# EAGLE design pcb (EAGLE 9.5.2)
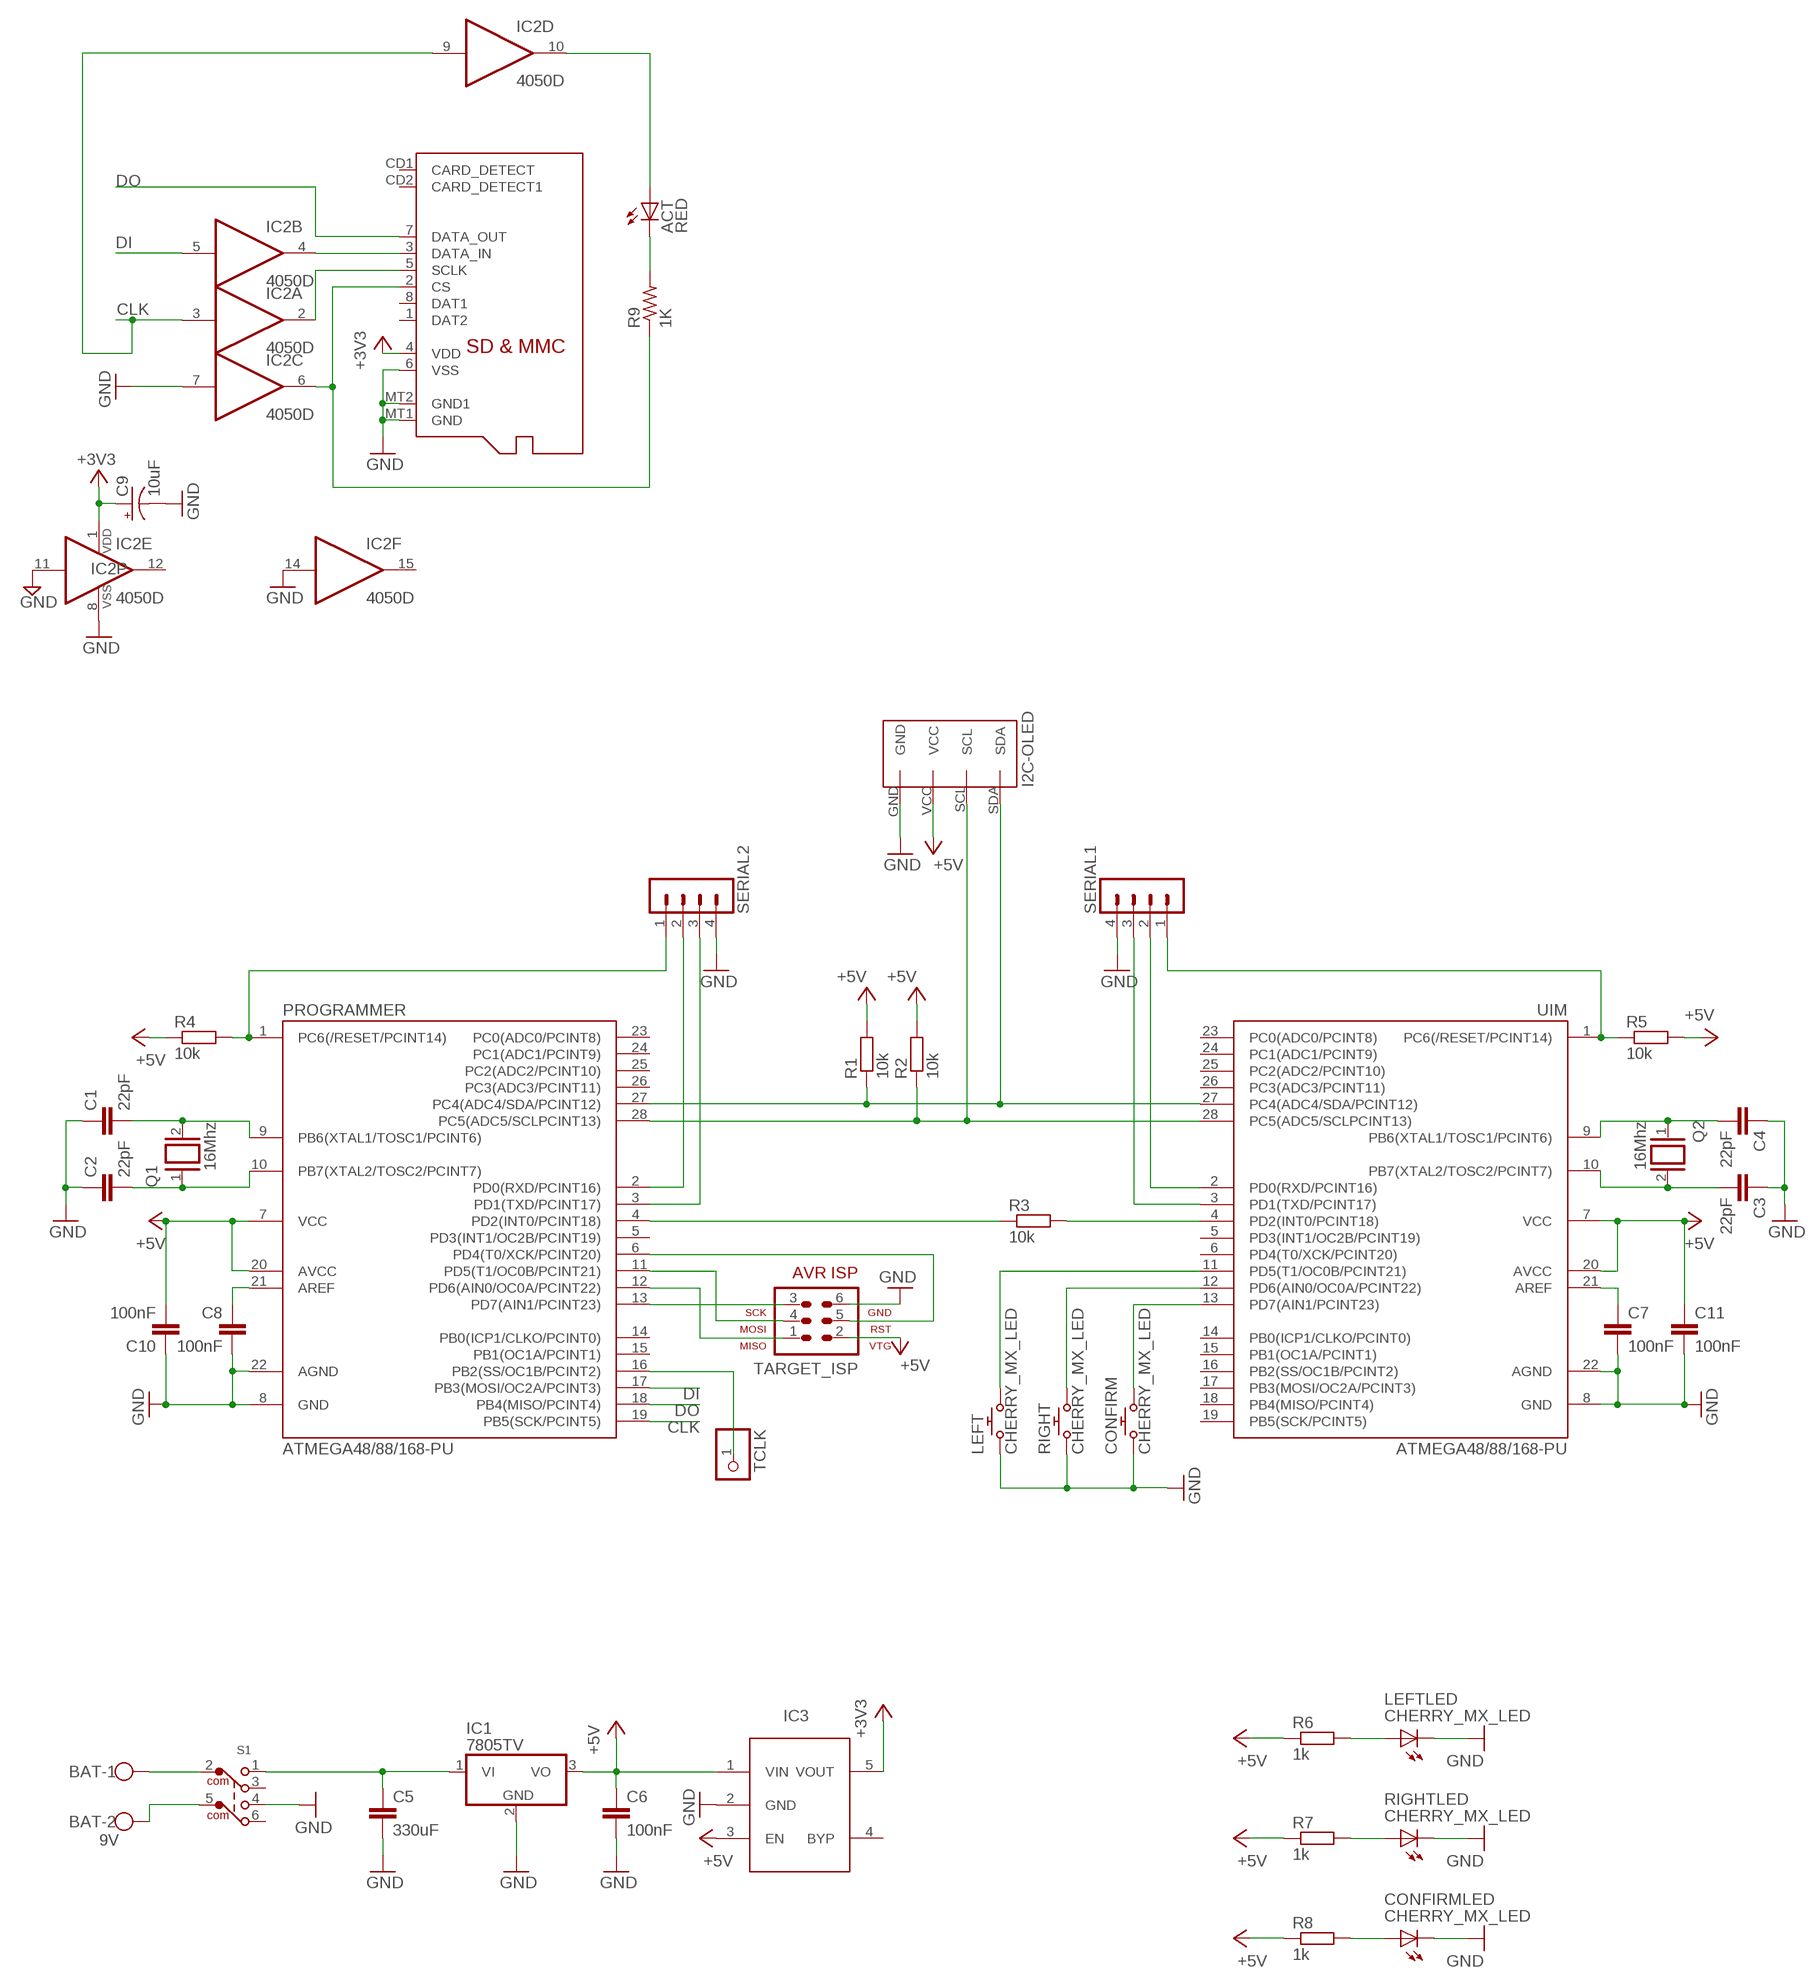
[diagram p0: schematic, sheet 1]

## Parts
ACT  RED  LEDCHIP-LED0805  [CHIP-LED0805]
BAT  9V  W237-102  [W237-102]
C1  22pF  C-EUC0805  [C0805]
C2  22pF  C-EUC0805  [C0805]
C3  22pF  C-EUC0805  [C0805]
C4  22pF  C-EUC0805  [C0805]
C5  330uF  C-EUC0805  [C0805]
C6  100nF  C-EUC0805  [C0805]
C7  100nF  C-EUC0805  [C0805]
C8  100nF  C-EUC0805  [C0805]
C9  10uF  CPOL-USA/3216-18R  [A/3216-18R]
C10  100nF  C-EUC0805  [C0805]
C11  100nF  C-EUC0805  [C0805]
CONFIRM  CHERRY_MX_LED  [CHERRY_MX_LED]
IC1  7805TV  [TO220V]
IC2  4050D  [SO16]
IC3  LP298XS  [SOT23-5L]
LEFT  CHERRY_MX_LED  [CHERRY_MX_LED]
PROGRAMMER  ATMEGA48/88/168-PU  [DIL28-3]
Q1  16Mhz  XTAL/S  [QS]
Q2  16Mhz  XTAL/S  [QS]
R1  10k  R-EU_R0805  [R0805]
R2  10k  R-EU_R0805  [R0805]
R3  10k  R-EU_R0805  [R0805]
R4  10k  R-EU_R0805  [R0805]
R5  10k  R-EU_R0805  [R0805]
R6  1k  R-EU_R0805  [R0805]
R7  1k  R-EU_R0805  [R0805]
R8  1k  R-EU_R0805  [R0805]
R9  1K  R-US_R0805  [R0805]
RIGHT  CHERRY_MX_LED  [CHERRY_MX_LED]
S1  452404020202  [452404020202]
SERIAL1  MA04-1  [MA04-1]
SERIAL2  MA04-1  [MA04-1]
TARGET_ISP  AVR-ISP-6  [AVR-ISP-6]
TCLK  PINHD-1X1  [1X01]
U$1  128X64-I2C-OLED  [128X64-I2C-OLED]
UIM  ATMEGA48/88/168-PU  [DIL28-3]
X1  MICROSD  [MICROSD]

## Nets
9V+ [power]: C5.1 IC1.1(VI) S1.1
+3V3 [power]: C9.+ IC2.1(P:VDD) IC3.5(VOUT) X1.4(VDD)
+5V [power]: C6.1 C10.2 C11.1 IC1.3(VO) IC3.1(VIN) IC3.3(EN) PROGRAMMER.7(VCC) PROGRAMMER.20(AVCC) R1.2 R2.2 R4.1 R5.2 R6.1 R7.1 R8.1 TARGET_ISP.2 U$1.VCC UIM.7(VCC) UIM.20(AVCC)
B$1: PROGRAMMER.11(PD5(T1/OC0B/PCINT21)) TARGET_ISP.4
BAT+ [power]: BAT.1 S1.2(COM)
BAT- [power]: BAT.2 S1.5(COM1)
CLK: IC2.3(A:I) IC2.9(D:I) PROGRAMMER.19(PB5(SCK/PCINT5))
DI: IC2.5(B:I) PROGRAMMER.17(PB3(MOSI/OC2A/PCINT3))
DO: PROGRAMMER.18(PB4(MISO/PCINT4)) X1.7(DATA_OUT)
GND [power]: C1.1 C2.1 C3.1 C4.1 C5.2 C6.2 C7.2 C8.2 C9.- C10.1 C11.2 CONFIRM.L2(C) CONFIRM.S1 IC1.2(GND) IC2.7(C:I) IC2.8(P:VSS) IC2.11(E:I) IC2.14(F:I) IC3.2(GND) LEFT.L2(C) LEFT.S1 PROGRAMMER.8(GND) PROGRAMMER.22(AGND) RIGHT.L2(C) RIGHT.S1 S1.4 SERIAL1.4 SERIAL2.4 TARGET_ISP.6 U$1.GND UIM.8(GND) UIM.22(AGND) X1.6(VSS) X1.MT1(GND) X1.MT2(GND1)
N$1: PROGRAMMER.28(PC5(ADC5/SCLPCINT13)) R2.1 U$1.SCL UIM.28(PC5(ADC5/SCLPCINT13))
N$2: PROGRAMMER.27(PC4(ADC4/SDA/PCINT12)) R1.1 U$1.SDA UIM.27(PC4(ADC4/SDA/PCINT12))
N$3: PROGRAMMER.4(PD2(INT0/PCINT18)) R3.1
N$4: R3.2 UIM.4(PD2(INT0/PCINT18))
N$5: PROGRAMMER.1(PC6(/RESET/PCINT14)) R4.2 SERIAL2.1
N$6: R5.1 SERIAL1.1 UIM.1(PC6(/RESET/PCINT14))
N$7: C1.2 PROGRAMMER.9(PB6(XTAL1/TOSC1/PCINT6)) Q1.2
N$8: C2.2 PROGRAMMER.10(PB7(XTAL2/TOSC2/PCINT7)) Q1.1
N$9: LEFT.S2 UIM.11(PD5(T1/OC0B/PCINT21))
N$10: C3.2 Q2.2 UIM.10(PB7(XTAL2/TOSC2/PCINT7))
N$11: C4.2 Q2.1 UIM.9(PB6(XTAL1/TOSC1/PCINT6))
N$12: PROGRAMMER.12(PD6(AIN0/OC0A/PCINT22)) TARGET_ISP.1
N$13: PROGRAMMER.13(PD7(AIN1/PCINT23)) TARGET_ISP.3
N$14: PROGRAMMER.6(PD4(T0/XCK/PCINT20)) TARGET_ISP.5
N$15: RIGHT.S2 UIM.12(PD6(AIN0/OC0A/PCINT22))
N$16: CONFIRM.S2 UIM.13(PD7(AIN1/PCINT23))
N$18: LEFT.L1(A) R6.2
N$19: R7.2 RIGHT.L1(A)
N$20: CONFIRM.L1(A) R8.2
N$21: C7.1 UIM.21(AREF)
N$22: C8.1 PROGRAMMER.21(AREF)
N$23: ACT.A IC2.10(D:O)
N$24: IC2.2(A:O) X1.5(SCLK)
N$25: IC2.6(C:O) R9.1 X1.2(CS)
N$26: ACT.C R9.2
N$27: IC2.4(B:O) X1.3(DATA_IN)
N$28: PROGRAMMER.16(PB2(SS/OC1B/PCINT2)) TCLK.1
N$29: PROGRAMMER.2(PD0(RXD/PCINT16)) SERIAL2.2
N$30: PROGRAMMER.3(PD1(TXD/PCINT17)) SERIAL2.3
N$32: SERIAL1.2 UIM.2(PD0(RXD/PCINT16))
N$33: SERIAL1.3 UIM.3(PD1(TXD/PCINT17))
Unconnected: IC2.12(E:O) IC2.15(F:O) IC3.4(BYP) PROGRAMMER.5(PD3(INT1/OC2B/PCINT19)) PROGRAMMER.14(PB0(ICP1/CLKO/PCINT0)) PROGRAMMER.15(PB1(OC1A/PCINT1)) PROGRAMMER.23(PC0(ADC0/PCINT8)) PROGRAMMER.24(PC1(ADC1/PCINT9)) PROGRAMMER.25(PC2(ADC2/PCINT10)) PROGRAMMER.26(PC3(ADC3/PCINT11)) S1.3 S1.6 UIM.5(PD3(INT1/OC2B/PCINT19)) UIM.6(PD4(T0/XCK/PCINT20)) UIM.14(PB0(ICP1/CLKO/PCINT0)) UIM.15(PB1(OC1A/PCINT1)) UIM.16(PB2(SS/OC1B/PCINT2)) UIM.17(PB3(MOSI/OC2A/PCINT3)) UIM.18(PB4(MISO/PCINT4)) UIM.19(PB5(SCK/PCINT5)) UIM.23(PC0(ADC0/PCINT8)) UIM.24(PC1(ADC1/PCINT9)) UIM.25(PC2(ADC2/PCINT10)) UIM.26(PC3(ADC3/PCINT11)) X1.1(DAT2) X1.8(DAT1) X1.CD1(CARD_DETECT) X1.CD2(CARD_DETECT1)

## Notes on the sheet
- I2C-OLED

## Library data of the parts
ACT = adafruit:LED: LED OSRAM: - CHIPLED LG R971, LG N971, LY N971, LG Q971, LY Q971, LO R971, LY R971 LH N974, LH R974 LS Q976, LO Q976, LY Q976 LO Q996 - Hyper CHIPLED LW Q18S LB Q993, LB Q99A, LB R99A - SideLED LS A670, LO A670, LY A670, LG A670, LP A670 LB A673, LV A673, LT A673, LW A673 LH A674 LY A675 LS A676, LA A676, LO A676, LY A676, LW A676 LS A679, LY A679, LG A679 - Hyper Micro SIDELED® LS Y876, LA Y876, LO Y876, LY Y876 LT Y87S - SmartLED LW L88C, LW L88S LB L89C, LB L89S, LG L890 LS L89K, LO L89K, LY L89K LS L896, LA L896, LO L896, LY L896 - TOPLED LS T670, LO T670, LY T670, LG T670, LP T670 LSG T670, LSP T670, LSY T670, LOP T670, LYG T670 LG T671, LOG T671, LSG T671 LB T673, LV T673, LT T673, LW T673 LH T674 LS T676, LA T676, LO T676, LY T676, LB T676, LH T676, LSB T676, LW T676 LB T67C, LV T67C, LT T67C, LS T67K, LO T67K, LY T67K, LW E67C LS E67B, LA E67B, LO E67B, LY E67B, LB E67C, LV E67C, LT E67C LW T67C LS T679, LY T679, LG T679 LS T770, LO T770, LY T770, LG T770, LP T770 LB T773, LV T773, LT T773, LW T773 LH T774 LS E675, LA E675, LY E675, LS T675 LS T776, LA T776, LO T776, LY T776, LB T776 LHGB T686 LT T68C, LB T68C - Hyper Mini TOPLED® LB M676 - Mini TOPLED Santana® LG M470 LS M47K, LO M47K, LY M47K Source: http://www.osram.convergy.de/
BAT = con-wago-500:W237-102: WAGO SCREW CLAMP; MPN: 237-102; OC_FARNELL: unknown; OC_NEWARK: 70K9898
C1-C8 C10 C11 = rcl:C-EU: CAPACITOR, European symbol; SPICEPREFIX: C
C9 = adafruit:CPOL-US: POLARIZED CAPACITOR, American symbol
CONFIRM LEFT RIGHT = cherry:CHERRY_MX_LED: Cherry MX with LED; FARNELL: 2292961; MOUSER: 540_MX1A_11NW
IC1 = linear:78*: Positive VOLTAGE REGULATOR Source: http://cache.national.com/ds/LM/LM78L05.pdf http://www.fairchildsemi.com/ds/LM/LM7805.pdf
IC2 = 40xx:4050: Hex non-inverting BUFFER
IC3 = adafruit:LP298X
PROGRAMMER UIM = atmega8:ATMEGA48/88/168-PU
Q1 Q2 = special:XTAL/S: CRYSTAL
R1-R8 = rcl:R-EU_: RESISTOR, European symbol; SPICEPREFIX: R
R9 = adafruit:R-US_: RESISTOR, American symbol
S1 = Wurth_Switch_WS-SLTV:452404020202: WS-SLTV THT Mini Slide Switch, Same Side Connection 9.0x3.5 mm Properties Actuator Material:PA9T Actuator Flammability Rating:UL94 HB Actuator Color:Black Frame Material:LCP Frame Flammability Rating:UL94 V-0 Frame Color:Black Contact Material:Copper Alloy Contact Plating:Silver Terminal Material:Copper Alloy Terminal Plating:Silver Schematic:DPDT Switching Function:On-On Connection Type:Same Side Connection Operating Temperature:-40 up to +85 °C Qty.:200 Material Properties Cover Material :Stainless Steel Mechanical Properties Electrical Life:2000 Steps Switching Function:On-On Connection Type:Same Side Connection Packaging Properties Packaging :Bulk <https://www.we-online.com/catalog/media/o107346v209%20Family_WS-SLTV_452404020202.jpg> Details see: https://www.we-online.com/catalog/en/SLTV_9X3_5_THT/ Updated by yingchun,Shan;2020-02-24 2020(C) Würth Elektronik; DATASHEET-URL: https://www.we-online.com/catalog/datasheet/452404020202.pdf; PACKAGING: Bulk; PART-NUMBER: 452404020202; QTY: 200
SERIAL1 SERIAL2 = con-lstb:MA04-1: PIN HEADER; OC_FARNELL: unknown; OC_NEWARK: unknown
TARGET_ISP = atmel:AVR-ISP-6: AVR ISP-6 Serial Programming Header
TCLK = pinhead:PINHD-1X1: PIN HEADER
U$1 = Parts:128X64-I2C-OLED
X1 = adafruit:MICROSD: Micro-SD / Transflash card holder with SPI pinout For the 3M # 2908-05WB-MG and/or 4UCON #19656 push-push type

## Net classes
0 default: width 0.508 mm
1 power: width 0.508 mm

## Board
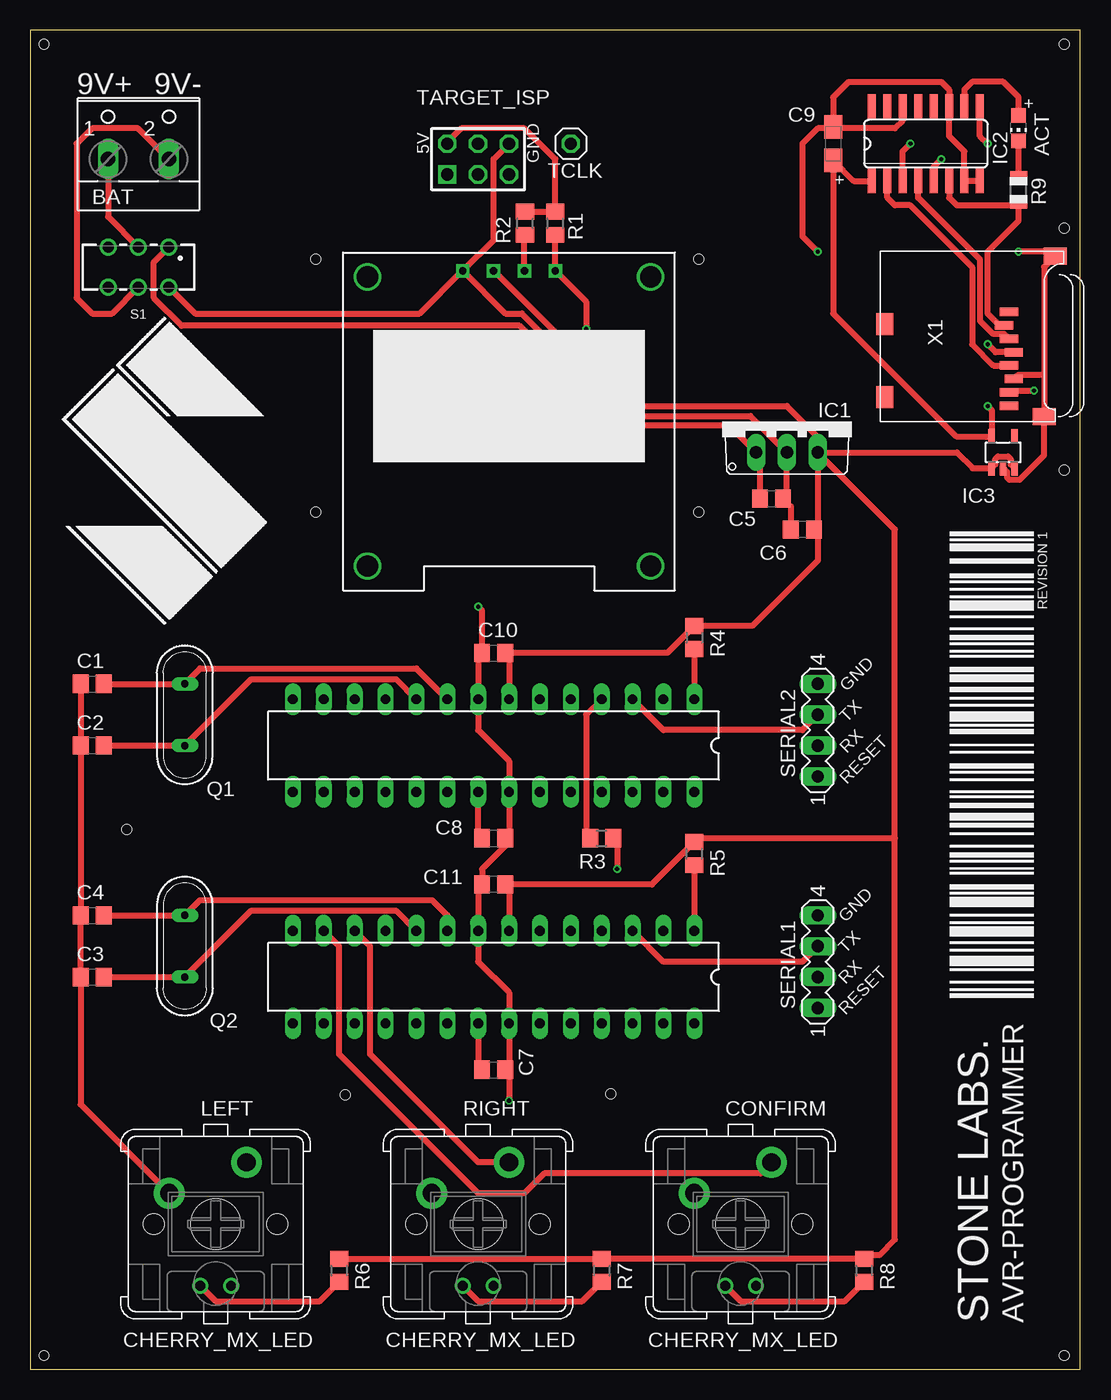
[diagram p1: board, top side]
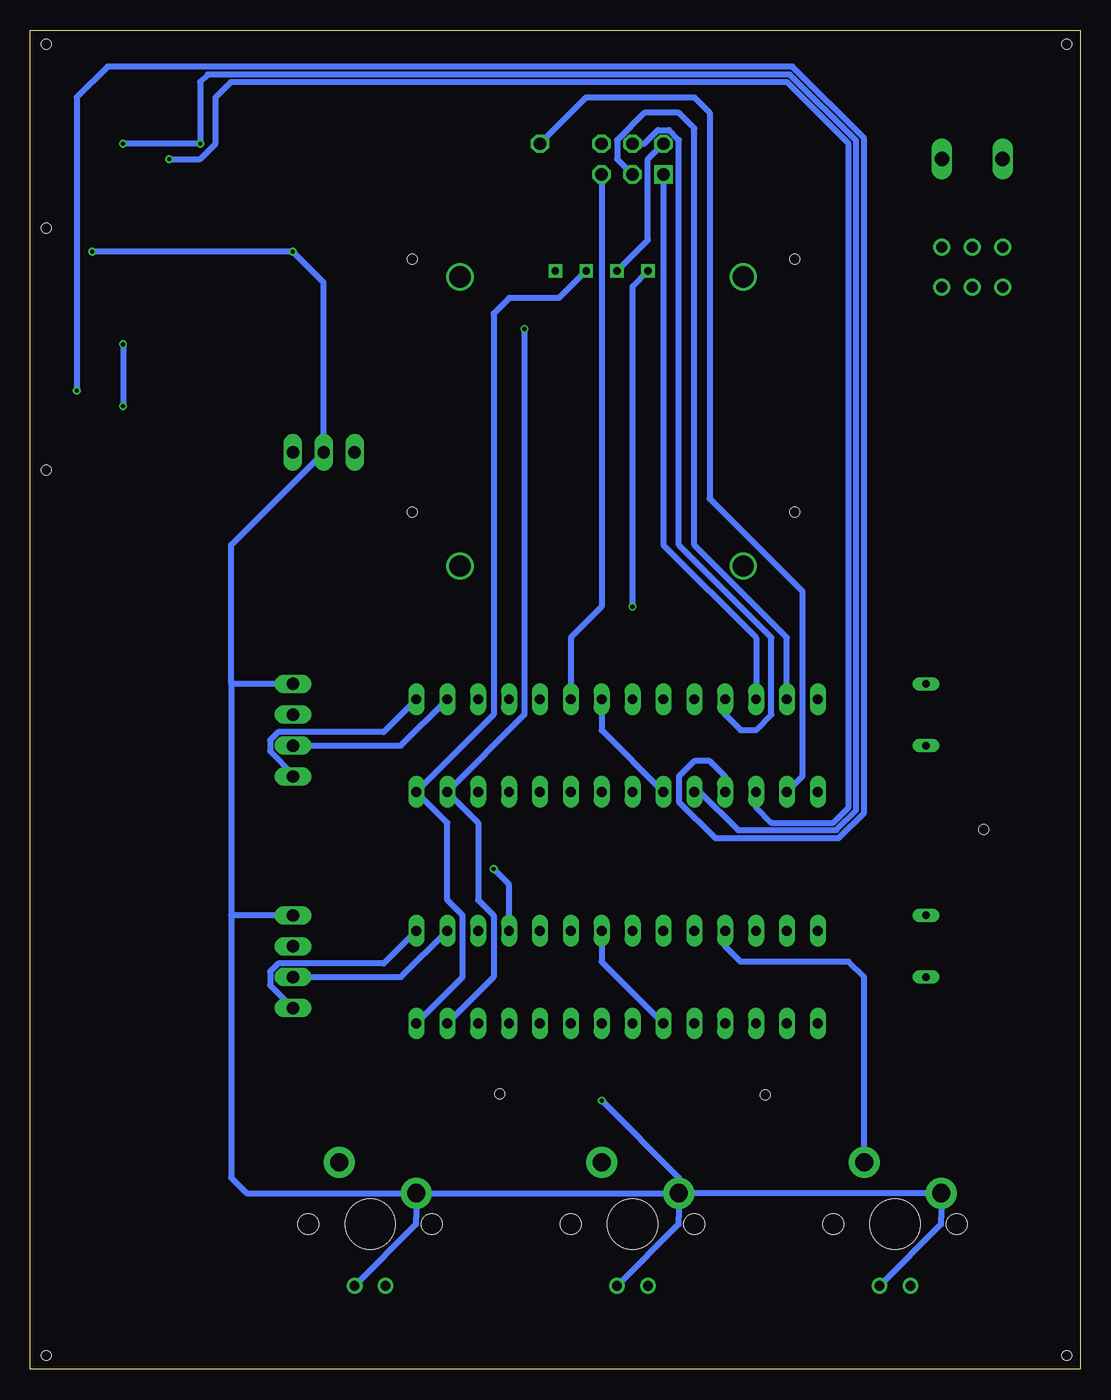
[diagram p2: board, bottom side, seen from below]

Size 86.36 x 110.16 mm. Coordinates in mm from the lower left corner, seen from the top.
Outline: 0,0 86.36,0 86.36,110.16 0,110.16 0,0
Copper layers (1*16): Top 0.035mm / dielectric 1.5mm / Bottom 0.035mm
Design rules "aisler_2_layer": minimum track width 0.1mm, minimum drill 0.2mm, track to track 0.1mm, track to pad 0.1mm, pad to pad 0.1mm, via to via 0.1mm, smd to smd 0.1mm, copper to edge 0.2mm, drill to drill 0.21mm, minimum pad ring 0.25mm, minimum via ring 0.15mm, stop-mask expansion 0mil, vias tented up to drill 0mil, thermal gap 10mil
Holes 0.8 mm at 1.12,1.12 1.12,109.02 85.04,109.02 85.04,1.12 85.04,93.88 85.04,73.96 54.97,70.51 23.47,70.51 23.47,91.34 54.97,91.34 47.75,22.66 25.91,22.56 7.92,44.4

### Footprints (pad centres in the part's own frame; a part is rotated, then mirrored left to right if it is on the bottom)
CHIP-LED0805 = smd 1.2 x 1.2: A 0,-1.05; C 0,1.05
W237-102 = drill 1.194 long: 1 -2.5,-1.27; 2 2.5,-1.27
C0805 = smd 1.3 x 1.5: 1 -0.95,0; 2 0.95,0
A/3216-18R = smd 1.95 x 1.5: + 1.375,0; - -1.375,0
CHERRY_MX_LED = drill 0.8: L1 -1.27,-5.08; L2 1.27,-5.08 | drill 1.5 pad 2.54: S1 -3.81,2.54; S2 2.54,5.08 | hole 1.7: -5.08,0; 5.08,0 | hole 4.1: 0,0
TO220V = drill 1.016 long: 1 -2.54,-2.54; 2 0,-2.54; 3 2.54,-2.54
SO16 = smd 0.66 x 2.032: 1 -4.445,-3.073; 2 -3.175,-3.073; 3 -1.905,-3.073; 4 -0.635,-3.073; 5 0.635,-3.073; 6 1.905,-3.073; 7 3.175,-3.073; 8 4.445,-3.073; 9 4.445,3.073; 10 3.175,3.073; 11 1.905,3.073; 12 0.635,3.073; 13 -0.635,3.073; 14 -1.905,3.073; 15 -3.175,3.073; 16 -4.445,3.073
SOT23-5L = smd 0.55 x 1.2: 1 -0.95,-1.3; 2 0,-1.3; 3 0.95,-1.3; 4 0.95,1.3; 5 -0.95,1.3
DIL28-3 = drill 0.813 long: 1 -16.51,-3.81; 2 -13.97,-3.81; 3 -11.43,-3.81; 4 -8.89,-3.81; 5 -6.35,-3.81; 6 -3.81,-3.81; 7 -1.27,-3.81; 8 1.27,-3.81; 9 3.81,-3.81; 10 6.35,-3.81; 11 8.89,-3.81; 12 11.43,-3.81; 13 13.97,-3.81; 14 16.51,-3.81; 15 16.51,3.81; 16 13.97,3.81; 17 11.43,3.81; 18 8.89,3.81; 19 6.35,3.81; 20 3.81,3.81; 21 1.27,3.81; 22 -1.27,3.81; 23 -3.81,3.81; 24 -6.35,3.81; 25 -8.89,3.81; 26 -11.43,3.81; 27 -13.97,3.81; 28 -16.51,3.81
QS = drill 0.61 long: 1 -2.54,0; 2 2.54,0
R0805 = smd 1.3 x 1.5: 1 -0.95,0; 2 0.95,0
R0805' = smd 1.1 x 1.4: 1 -1,0; 2 1,0
452404020202 = drill 0.9: 1 2.5,1.65; 2 0,1.65; 3 -2.5,1.65; 4 2.5,-1.65; 5 0,-1.65; 6 -2.5,-1.65
MA04-1 = drill 1.016 long: 1 -3.81,0; 2 -1.27,0; 3 1.27,0; 4 3.81,0
AVR-ISP-6 = drill 1.016 square: 1 -2.54,-1.27 | drill 1.016 octagon: 2 -2.54,1.27; 3 0,-1.27; 4 0,1.27; 5 2.54,-1.27; 6 2.54,1.27
1X01 = drill 1.016 octagon: 1 0,0
128X64-I2C-OLED = drill 0.6 square: GND -3.81,12.4; SCL 1.27,12.4; SDA 3.81,12.4; VCC -1.27,12.4 | drill 1.75: P$1 -11.65,-11.9; P$2 11.65,-11.9; P$3 11.65,11.9; P$4 -11.65,11.9
MICROSD = smd 0.7 x 1.5: 1 9,-10.64; 2 7.9,-10.24; 3 6.8,-10.64; 4 5.7,-11.04; 5 4.6,-10.64; 6 3.5,-11.04; 7 2.4,-10.64; 8 1.3,-10.64 | smd 1.8 x 1.4: CD1 2,-0.44; CD2 8,-0.44 | smd 1.4 x 1.9: MT1 0.4,-13.54; MT2 13.6,-14.44

### Placement (x,y rotation side)
ACT  81.28,102.11 180 top
BAT  8.89,100.84 0 top
C1  5.08,56.39 0 top
C2  5.08,51.31 0 top
C3  5.08,32.26 0 top
C4  5.08,37.34 0 top
C5  60.96,71.63 0 top
C6  63.5,69.09 180 top
C7  38.1,24.64 0 top
C8  38.1,43.69 0 top
C9  66.04,100.84 270 top
C10  38.1,58.93 0 top
C11  38.1,39.88 180 top
CONFIRM  58.42,11.94 0 top
IC1  62.23,77.98 0 top
IC2  73.66,100.84 0 top
IC3  80.01,75.44 0 top
LEFT  15.24,11.94 0 top
PROGRAMMER  38.1,51.31 180 top
Q1  12.7,53.85 90 top
Q2  12.7,34.8 270 top
R1  43.18,94.28 90 top
R2  40.69,94.28 90 top
R3  46.99,43.69 0 top
R4  54.61,60.2 270 top
R5  54.61,42.42 90 top
R6  25.4,8.13 270 top
R7  46.99,8.13 270 top
R8  68.58,8.13 270 top
R9  1K  [R0805']  81.28,97.03 90 top
RIGHT  36.83,11.94 0 top
S1  8.89,90.68 0 top
SERIAL1  64.77,33.53 90 top
SERIAL2  64.77,52.58 90 top
TARGET_ISP  36.83,99.57 0 top
TCLK  44.45,100.84 0 top
U$1  39.37,77.98 0 top
UIM  38.1,32.26 180 top
X1  69.85,77.98 90 top

### Tracks (layer width: path | path; a pad name or v marks a point on that pad's centre or on a via)
9V+
  Top 0.508: S1.1 10.16,91.1 10.16,88.14 12.45,85.85 40.23,85.85 48.46,77.62 57.5,77.62 IC1.1 60.01,75.12 C5.1
+3V3  (via drill 0.35)
  Top 0.508: IC2.1 67.74,97.77 C9.+ 66.04,86.87 76.17,76.74 IC3.5 79.06,78.93 v78.74,79.25 | X1.4 79.39,83.68 v78.74,84.33
  Bottom 0.508: v78.74,84.33 v78.74,79.25
+5V
  Top 0.508: PROGRAMMER.7 39.37,58.61 C10.2 52.39,58.93 53.71,60.25 R4.1 59.37,61.15 64.77,66.55 64.77,68.77 C6.1 64.77,69.41 IC1.3 | U$1.VCC 49.23,79.25 62.23,79.25 64.77,76.71 IC1.3 | R6.1 R7.1 R8.1 68.9,9.4 69.85,9.4 71.12,10.67 71.12,43.69 | 71.12,43.69 71.12,69.09 IC1.3 | UIM.7 39.37,39.56 C11.1 51.12,39.88 53.71,42.47 R5.2 54.93,43.69 71.12,43.69 | IC3.3 80.64,74.46 80.64,74.89 80.43,75.09 79.59,75.09 79.38,74.89 79.38,74.46 IC3.1 77.5,74.14 76.2,75.44 IC1.3 | R2.2 R1.2 43.18,99.57 40.64,102.11 35.46,102.11 34.29,100.94 TARGET_ISP.2
  Bottom 0.508: U$1.VCC 35.56,92.92 35.56,99.57 TARGET_ISP.2 | PROGRAMMER.7 39.37,52.58 PROGRAMMER.20 | UIM.7 39.37,33.53 UIM.20
B$1
  Bottom 0.508: TARGET_ISP.4 35.86,100.84 34.75,101.95 33.83,101.95 33.02,101.14 33.02,67.82 25.4,60.2 25.4,53.85 26.67,52.58 27.94,52.58 29.21,53.85 PROGRAMMER.11
BAT+
  Top 0.508: BAT.1 6.39,94.83 S1.2
BAT-
  Top 0.508: BAT.2 8.85,102.11 5.08,102.11 3.81,100.84 3.81,88.14 5.08,86.87 6.73,86.87 S1.5
CLK  (via drill 0.35)
  Top 0.508: IC2.3 71.75,100.2 v72.39,100.84 | v78.74,100.84 78.11,101.47 IC2.9
  Bottom 0.508: v78.74,100.84 v72.39,100.84 72.39,105.92 71.78,106.53 23.88,106.53 18.44,101.09 18.44,45.98 20.07,44.35 28.15,44.35 31.3,47.5 PROGRAMMER.19
DI  (via drill 0.35)
  Top 0.508: IC2.5 74.3,98.93 v74.93,99.57
  Bottom 0.508: PROGRAMMER.17 26.67,46.23 25.4,44.96 20.32,44.96 19.05,46.23 19.05,100.84 24.13,105.92 69.85,105.92 71.12,104.65 71.12,100.84 72.39,99.57 v74.93,99.57
DO  (via drill 0.35)
  Top 0.508: X1.7 80.63,80.52 v82.55,80.52
  Bottom 0.508: v82.55,80.52 82.55,104.65 80.01,107.19 23.68,107.19 17.78,101.29 17.78,45.78 19.87,43.69 30.02,43.69 33.02,46.68 33.02,48.77 31.75,50.04 30.48,50.04 29.21,48.77 PROGRAMMER.18
GND  (via drill 0.35)
  Top 0.508: U$1.GND 35.52,90.38 32.01,86.87 13.55,86.87 S1.4 | LEFT.S1 4.13,21.78 C3.1 C4.1 C2.1 C1.1 | C7.2 39.21,24.48 | 39.21,24.48 39.37,24.32 v39.37,22.1 | 39.21,24.48 39.37,24.64 UIM.22 39.37,30.99 36.83,33.53 UIM.8 36.83,39.56 C11.2 37.15,41.15 39.05,43.05 C8.2 39.37,44.01 PROGRAMMER.22 39.37,50.04 36.83,52.58 PROGRAMMER.8 36.83,58.61 C10.1 37.15,62.42 v36.83,62.74 | IC3.2 80.33,73.82 80.33,73.39 80.54,73.18 81.38,73.18 83.39,75.19 X1.MT1 83.39,81.79 | 83.39,81.79 83.39,90.68 X1.MT2 83.87,92 81.33,92 v81.28,91.95 | IC2.8 IC2.7 76.83,100.2 75.56,101.47 IC2.11 75.56,105.28 74.93,105.92 67.31,105.92 66.04,104.65 C9.- | X1.6 81.2,81.79 83.39,81.79 | C9.- 65.94,102.11 64.77,102.11 63.5,100.84 63.5,93.22 v64.77,91.95 | IC2.14 71.75,102.74 71.12,102.11 66.14,102.11 C9.- | C6.2 62.55,70.99 C5.2 62.23,71.95 IC1.2 59.23,78.44 48.87,78.44 40.44,86.87 39.07,86.87 U$1.GND | U$1.GND 38.1,92.92 38.1,99.57 TARGET_ISP.6
  Bottom 0.508: RIGHT.S1 LEFT.S1 11.43,12.51 11.46,12.48 11.46,11.9 LEFT.L2 | CONFIRM.S1 RIGHT.S1 | RIGHT.S1 33.02,12.51 33.05,12.48 33.05,11.9 RIGHT.L2 | CONFIRM.S1 54.61,12.51 54.64,12.48 54.64,11.9 CONFIRM.L2 | v39.37,22.1 33.02,15.75 RIGHT.S1 | SERIAL2.4 69.85,56.39 | 69.85,56.39 69.85,67.82 IC1.2 62.23,89.41 v64.77,91.95 v81.28,91.95 | CONFIRM.S1 68.58,14.48 69.85,15.75 69.85,37.34 | 69.85,56.39 69.85,37.34 | SERIAL1.4 69.85,37.34 | v36.83,62.74 36.83,89.11 U$1.GND
N$1
  Top 0.508: 40.64,90.78 U$1.SCL 40.64,93.28 R2.1
  Bottom 0.508: U$1.SCL 42.88,88.14 46.99,88.14 48.26,86.87 48.26,53.85 PROGRAMMER.28 52.07,44.96 52.07,38.61 50.8,37.34 50.8,32.26 UIM.28
N$2  (via drill 0.35)
  Top 0.508: v45.72,85.6 45.72,87.84 U$1.SDA R1.1
  Bottom 0.508: v45.72,85.6 45.72,53.85 PROGRAMMER.27 49.53,44.96 49.53,38.61 48.26,37.34 48.26,32.26 UIM.27
N$3
  Top 0.508: PROGRAMMER.4 45.72,53.85 45.72,44.01 R3.1
N$4  (via drill 0.35)
  Top 0.508: R3.2 48.26,43.37 v48.26,41.15
  Bottom 0.508: UIM.4 46.99,39.88 v48.26,41.15
N$5
  Top 0.508: R4.2 PROGRAMMER.1
  Bottom 0.508: PROGRAMMER.1 57.31,52.42 65.99,52.42 66.64,51.77 66.64,50.85 64.77,48.98 SERIAL2.1
N$6
  Top 0.508: R5.1 UIM.1
  Bottom 0.508: UIM.1 57.31,33.37 65.99,33.37 66.64,32.72 66.64,31.59 SERIAL1.1
N$7
  Top 0.508: C1.2 Q1.2 13.97,57.66 31.75,57.66 PROGRAMMER.9
N$8
  Top 0.508: C2.2 Q1.1 18.18,56.78 30.08,56.78 PROGRAMMER.10
N$9
  Bottom 0.508: LEFT.S2 17.78,32.26 19.05,33.53 27.94,33.53 29.21,34.8 UIM.11
N$10
  Top 0.508: C3.2 Q2.2 18.18,37.73 30.08,37.73 UIM.10
N$11
  Top 0.508: C4.2 Q2.1 13.97,38.61 33.02,38.61 34.29,37.34 UIM.9
N$12
  Bottom 0.508: TARGET_ISP.1 34.29,67.82 26.67,60.2 PROGRAMMER.12
N$13
  Bottom 0.508: PROGRAMMER.13 24.13,60.2 31.75,67.82 31.75,102.11 33.02,103.38 35.86,103.38 38.1,101.14 38.1,99.57 TARGET_ISP.3
N$14
  Bottom 0.508: TARGET_ISP.5 39.37,62.74 41.91,60.2 PROGRAMMER.6
N$15
  Top 0.508: RIGHT.S2 36.83,17.02 27.94,25.91 27.94,34.8 UIM.12
N$16
  Top 0.508: CONFIRM.S2 60.04,16.1 42.26,16.1 40.64,14.48 36.83,14.48 25.4,25.91 25.4,34.8 UIM.13
N$18
  Top 0.508: LEFT.L1 15.24,5.59 23.81,5.59 R6.2
N$19
  Top 0.508: RIGHT.L1 36.83,5.59 45.4,5.59 R7.2
N$20
  Top 0.508: CONFIRM.L1 58.42,5.59 66.99,5.59 R8.2
N$21
  Top 0.508: UIM.21 36.83,24.96 C7.1
N$22
  Top 0.508: C8.1 36.83,44.01 PROGRAMMER.21
N$23
  Top 0.508: ACT.A 81.28,104.65 80.01,105.92 77.47,105.92 76.83,105.28 IC2.10
N$24
  Top 0.508: IC2.2 70.48,96.39 71.12,95.76 72.39,95.76 77.47,90.68 77.47,84.33 79.22,82.58 X1.5
N$25
  Top 0.508: IC2.6 75.56,96.39 76.2,95.76 81.01,95.76 R9.1 81.28,94.49 78.74,91.95 78.74,86.87 79.73,85.88 X1.2
N$26
  Top 0.508: R9.2 ACT.C
N$27
  Top 0.508: X1.3 80.09,85.17 79.19,85.17 78.13,86.23 78.13,91.29 73.03,96.39 IC2.4
N$28
  Bottom 0.508: TCLK.1 40.64,104.65 31.75,104.65 30.48,103.38 30.48,71.63 22.86,64.01 22.86,48.77 PROGRAMMER.16
N$29
  Bottom 0.508: SERIAL2.2 55.88,51.31 PROGRAMMER.2
N$30
  Top 0.508: SERIAL2.3 63.5,52.58 52.07,52.58 PROGRAMMER.3
N$32
  Bottom 0.508: UIM.2 55.88,32.26 SERIAL1.2
N$33
  Top 0.508: UIM.3 52.07,33.53 63.5,33.53 SERIAL1.3

### Text on the board
tNames: 9V+ | 9V- | 5V | GND | REVISION 1 | GND | TX | RX | RESET | GND | TX | RX | RESET | STONE LABS. | AVR-PROGRAMMER